# EAGLE design 4axis_DRV8818 (EAGLE 7.6.0)
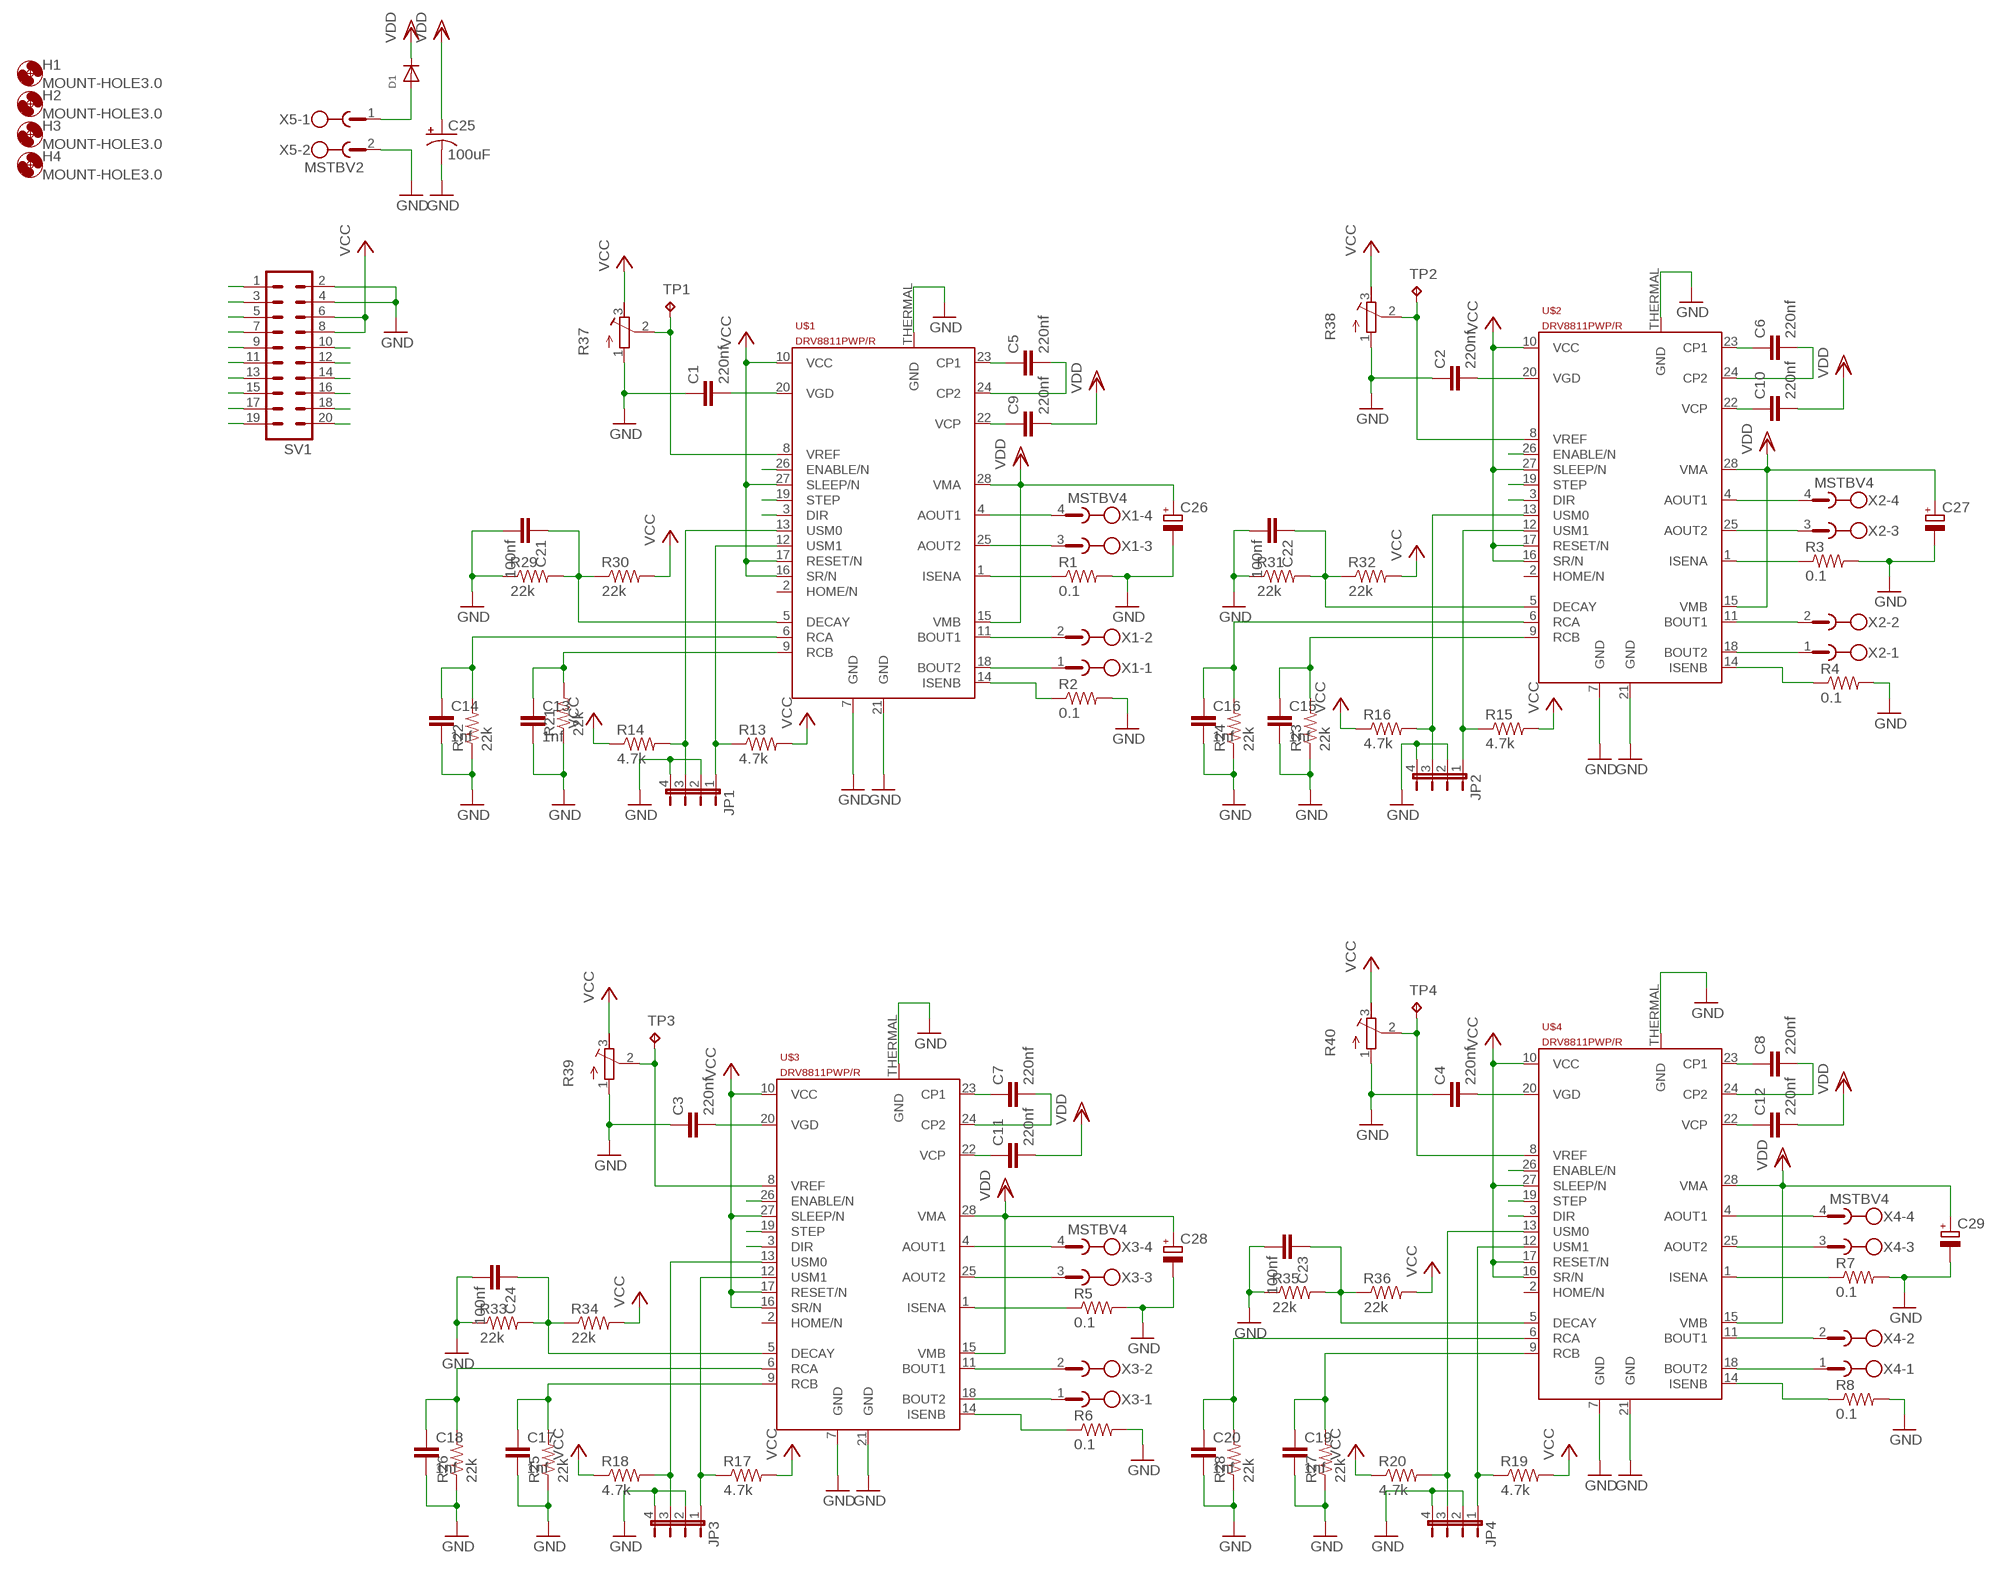
[diagram p0: schematic, sheet 1]

## Parts
C1  220nf  C-EUC1206  [C1206]
C2  220nf  C-EUC1206  [C1206]
C3  220nf  C-EUC1206  [C1206]
C4  220nf  C-EUC1206  [C1206]
C5  220nf  C-EUC1206  [C1206]
C6  220nf  C-EUC1206  [C1206]
C7  220nf  C-EUC1206  [C1206]
C8  220nf  C-EUC1206  [C1206]
C9  220nf  C-EUC1206  [C1206]
C10  220nf  C-EUC1206  [C1206]
C11  220nf  C-EUC1206  [C1206]
C12  220nf  C-EUC1206  [C1206]
C13  1nf  C-EUC1206  [C1206]
C14  1nf  C-EUC1206  [C1206]
C15  1nf  C-EUC1206  [C1206]
C16  1nf  C-EUC1206  [C1206]
C17  1nf  C-EUC1206  [C1206]
C18  1nf  C-EUC1206  [C1206]
C19  1nf  C-EUC1206  [C1206]
C20  1nf  C-EUC1206  [C1206]
C21  100nf  C-EUC1206  [C1206]
C22  100nf  C-EUC1206  [C1206]
C23  100nf  C-EUC1206  [C1206]
C24  100nf  C-EUC1206  [C1206]
C25  100uF  100UF-63V-20%(ELECT)  [NIC_10X10.5_CAP]
C26  CPOL-EUD  [PANASONIC_D]
C27  CPOL-EUD  [PANASONIC_D]
C28  CPOL-EUD  [PANASONIC_D]
C29  CPOL-EUD  [PANASONIC_D]
D1  DIODESMA  [SMADIODE]
H1  MOUNT-HOLE3.0  [3,0]
H2  MOUNT-HOLE3.0  [3,0]
H3  MOUNT-HOLE3.0  [3,0]
H4  MOUNT-HOLE3.0  [3,0]
JP1  JP4E  [JP4]
JP2  JP4E  [JP4]
JP3  JP4E  [JP4]
JP4  JP4E  [JP4]
R1  0.1  R-US_R2512  [R2512]
R2  0.1  R-US_R2512  [R2512]
R3  0.1  R-US_R2512  [R2512]
R4  0.1  R-US_R2512  [R2512]
R5  0.1  R-US_R2512  [R2512]
R6  0.1  R-US_R2512  [R2512]
R7  0.1  R-US_R2512  [R2512]
R8  0.1  R-US_R2512  [R2512]
R13  4.7k  R-US_R1206  [R1206]
R14  4.7k  R-US_R1206  [R1206]
R15  4.7k  R-US_R1206  [R1206]
R16  4.7k  R-US_R1206  [R1206]
R17  4.7k  R-US_R1206  [R1206]
R18  4.7k  R-US_R1206  [R1206]
R19  4.7k  R-US_R1206  [R1206]
R20  4.7k  R-US_R1206  [R1206]
R21  22k  R-US_R1206  [R1206]
R22  22k  R-US_R1206  [R1206]
R23  22k  R-US_R1206  [R1206]
R24  22k  R-US_R1206  [R1206]
R25  22k  R-US_R1206  [R1206]
R26  22k  R-US_R1206  [R1206]
R27  22k  R-US_R1206  [R1206]
R28  22k  R-US_R1206  [R1206]
R29  22k  R-US_R1206  [R1206]
R30  22k  R-US_R1206  [R1206]
R31  22k  R-US_R1206  [R1206]
R32  22k  R-US_R1206  [R1206]
R33  22k  R-US_R1206  [R1206]
R34  22k  R-US_R1206  [R1206]
R35  22k  R-US_R1206  [R1206]
R36  22k  R-US_R1206  [R1206]
R37  R-TRIMM3103  [RTRIM3103]
R38  R-TRIMM3103  [RTRIM3103]
R39  R-TRIMM3103  [RTRIM3103]
R40  R-TRIMM3103  [RTRIM3103]
SV1  ML20  [ML20]
TP1  TPTP20R  [TP20R]
TP2  TPTP20R  [TP20R]
TP3  TPTP20R  [TP20R]
TP4  TPTP20R  [TP20R]
U$1  DRV8811PWP/R  [HTSSOP28]
U$2  DRV8811PWP/R  [HTSSOP28]
U$3  DRV8811PWP/R  [HTSSOP28]
U$4  DRV8811PWP/R  [HTSSOP28]
X1  MSTBV4  [MSTBV4]
X2  MSTBV4  [MSTBV4]
X3  MSTBV4  [MSTBV4]
X4  MSTBV4  [MSTBV4]
X5  MSTBV2  [MSTBV2]

## Nets
E-DıR: SV1.14 U$4.3(DIR)
E-EN: SV1.16 U$4.26(ENABLE/N)
E-ERR: SV1.10
E-ISENA: R7.1 U$4.1(ISENA)
E-ISENB: R8.1 U$4.14(ISENB)
E-STEP: SV1.12 U$4.19(STEP)
GND: C1.1 C2.1 C3.1 C4.1 C13.2 C14.2 C15.2 C16.2 C17.2 C18.2 C19.2 C20.2 C21.2 C22.2 C23.2 C24.2 C25.- C26.- C27.- C28.- C29.- JP1.2 JP1.4 JP2.2 JP2.4 JP3.2 JP3.4 JP4.2 JP4.4 R1.2 R2.2 R3.2 R4.2 R5.2 R6.2 R7.2 R8.2 R21.1 R22.1 R23.1 R24.1 R25.1 R26.1 R27.1 R28.1 R29.1 R31.1 R33.1 R35.1 R37.1(A) R38.1(A) R39.1(A) R40.1(A) SV1.2 SV1.4 U$1.7(GND) U$1.21(GND) U$1.THERMAL(GND) U$2.7(GND) U$2.21(GND) U$2.THERMAL(GND) U$3.7(GND) U$3.21(GND) U$3.THERMAL(GND) U$4.7(GND) U$4.21(GND) U$4.THERMAL(GND) X5.2
N$1: C4.2 U$4.20(VGD)
N$2: C2.2 U$2.20(VGD)
N$3: C1.2 U$1.20(VGD)
N$4: U$1.4(AOUT1) X1.4
N$5: U$1.25(AOUT2) X1.3
N$6: U$1.11(BOUT1) X1.2
N$7: U$1.18(BOUT2) X1.1
N$8: U$2.4(AOUT1) X2.4
N$9: U$2.25(AOUT2) X2.3
N$10: U$2.11(BOUT1) X2.2
N$11: U$2.18(BOUT2) X2.1
N$12: U$4.4(AOUT1) X4.4
N$13: U$4.25(AOUT2) X4.3
N$14: U$4.11(BOUT1) X4.2
N$15: U$4.18(BOUT2) X4.1
N$16: U$3.4(AOUT1) X3.4
N$17: U$3.25(AOUT2) X3.3
N$18: U$3.11(BOUT1) X3.2
N$19: U$3.18(BOUT2) X3.1
N$20: C3.2 U$3.20(VGD)
N$21: C5.1 U$1.23(CP1)
N$22: C5.2 U$1.24(CP2)
N$23: C6.1 U$2.23(CP1)
N$24: C6.2 U$2.24(CP2)
N$25: C8.1 U$4.23(CP1)
N$26: C8.2 U$4.24(CP2)
N$27: C7.1 U$3.23(CP1)
N$28: C7.2 U$3.24(CP2)
N$29: C9.1 U$1.22(VCP)
N$30: C10.1 U$2.22(VCP)
N$31: C12.1 U$4.22(VCP)
N$32: C11.1 U$3.22(VCP)
N$33: R38.2(S) TP2.TP U$2.8(VREF)
N$34: R37.2(S) TP1.TP U$1.8(VREF)
N$35: R39.2(S) TP3.TP U$3.8(VREF)
N$36: JP1.3 R14.2 U$1.13(USM0)
N$37: R40.2(S) TP4.TP U$4.8(VREF)
N$38: JP1.1 R13.1 U$1.12(USM1)
N$39: JP2.1 R15.1 U$2.12(USM1)
N$40: JP2.3 R16.2 U$2.13(USM0)
N$41: JP3.1 R17.1 U$3.12(USM1)
N$42: JP3.3 R18.2 U$3.13(USM0)
N$43: JP4.1 R19.1 U$4.12(USM1)
N$44: JP4.3 R20.2 U$4.13(USM0)
N$45: C15.1 R23.2 U$2.9(RCB)
N$46: C16.1 R24.2 U$2.6(RCA)
N$47: C13.1 R21.2 U$1.9(RCB)
N$48: C14.1 R22.2 U$1.6(RCA)
N$49: C17.1 R25.2 U$3.9(RCB)
N$50: C18.1 R26.2 U$3.6(RCA)
N$51: C19.1 R27.2 U$4.9(RCB)
N$52: C20.1 R28.2 U$4.6(RCA)
N$53: C21.1 R29.2 R30.1 U$1.5(DECAY)
N$54: C22.1 R31.2 R32.1 U$2.5(DECAY)
N$55: C24.1 R33.2 R34.1 U$3.5(DECAY)
N$57: C23.1 R35.2 R36.1 U$4.5(DECAY)
N$58: D1.A X5.1
VCC: R13.2 R14.1 R15.2 R16.1 R17.2 R18.1 R19.2 R20.1 R30.2 R32.2 R34.2 R36.2 R37.3(E) R38.3(E) R39.3(E) R40.3(E) SV1.6 SV1.8 U$1.10(VCC) U$1.16(SR/N) U$1.17(RESET/N) U$1.27(SLEEP/N) U$2.10(VCC) U$2.16(SR/N) U$2.17(RESET/N) U$2.27(SLEEP/N) U$3.10(VCC) U$3.16(SR/N) U$3.17(RESET/N) U$3.27(SLEEP/N) U$4.10(VCC) U$4.16(SR/N) U$4.17(RESET/N) U$4.27(SLEEP/N)
VDD: C9.2 C10.2 C11.2 C12.2 C25.+ C26.+ C27.+ C28.+ C29.+ D1.C U$1.15(VMB) U$1.28(VMA) U$2.15(VMB) U$2.28(VMA) U$3.15(VMB) U$3.28(VMA) U$4.15(VMB) U$4.28(VMA)
X-DıR: SV1.3 U$1.3(DIR)
X-EN: SV1.1 U$1.26(ENABLE/N)
X-ERR: SV1.7
X-ISENA: R1.1 U$1.1(ISENA)
X-STEP: SV1.5 U$1.19(STEP)
XISENB: R2.1 U$1.14(ISENB)
Y-DıR: SV1.11 U$2.3(DIR)
Y-EN: SV1.9 U$2.26(ENABLE/N)
Y-ERR: SV1.15
Y-ISENA: R3.1 U$2.1(ISENA)
Y-ISENB: R4.1 U$2.14(ISENB)
Y-STEP: SV1.13 U$2.19(STEP)
Z-DıR: SV1.19 U$3.3(DIR)
Z-EN: SV1.17 U$3.26(ENABLE/N)
Z-ERR: SV1.18
Z-ISENA: R5.1 U$3.1(ISENA)
Z-ISENB: R6.1 U$3.14(ISENB)
Z-STEP: SV1.20 U$3.19(STEP)
Unconnected: U$1.2(HOME/N) U$2.2(HOME/N) U$3.2(HOME/N) U$4.2(HOME/N)

## Library data of the parts
C1-C24 = resistor:C-EU: CAPACITOR, European symbol
C25 = SparkFun-Capacitors:100UF-63V-20%(ELECT): CAP-08362 100uF electrolytic SMT 63V 20%; PROD_ID: CAP-08362
C26-C29 = resistor:CPOL-EU: POLARIZED CAPACITOR, European symbol
D1 = adafruit:DIODE: Diode SMADIODE - SMA Surface Mount Package 20V 1A Schottky Diode Digikey: 641-1014-6-ND DO-1N4148 - Through Hole Small Current Diode SOD-123 20V 1 A (.5mV Vf) Schottky Diode - Digikey: MBRX120TPMSCT-ND SOD-323 10V 570mA (.38mV Vf, 3ns) Schottky Diode - Digikey: ZLLS410CT-ND SOD-523 30V 30mA Schottky Diode (RB751S-40TE61) - Digikey: RB751S-40TE61CT-ND SOT23-R/W - SOT23 Package (R = Solder Paste/Reflow Ovens, W = Hand-Soldering) BAT54Film 40V 300mA - Digikey: 497-7162-1-ND
H1-H4 = holes:MOUNT-HOLE: MOUNTING HOLE with drill center marker
JP1-JP4 = jumper:JP4E: JUMPER
R1-R8 R13-R36 = resistor:R-US_: RESISTOR, American symbol
R37-R40 = resistor:R-TRIMM: Trimm resistor
SV1 = con-harting-ml:ML20: HARTING; OC_FARNELL: unknown; OC_NEWARK: unknown
TP1-TP4 = testpad:TP: Test pad
U$1-U$4 = texas-drv8811:DRV8811: Stepper Motor Controller The DRV8811 IC provides an integrated stepper motor driver solution. The device has two H-bridge drivers, as well as microstepping indexer logic to control a stepper motor. The output driver block for each consists of N-channel power MOSFETs configured as full H-bridges to drive the motor windings. Source: http://www.ti.com/lit/ds/symlink/drv8811.pdf; MF: TEXAS INSTRUMENTS
X1-X4 = con-phoenix-508:MSTBV4: PHOENIX; MPN: MSTBV 2,5/4-GF-5.08; OC_FARNELL: 1792794; OC_NEWARK: 69R9847
X5 = con-phoenix-508:MSTBV2: PHOENIX; MPN: MSTBV 2,5/2-GF-5.08; OC_FARNELL: 1792792; OC_NEWARK: 69R9845

## Net classes
0 default: width 0.305 mm, clearance 0.205 mm

## Board
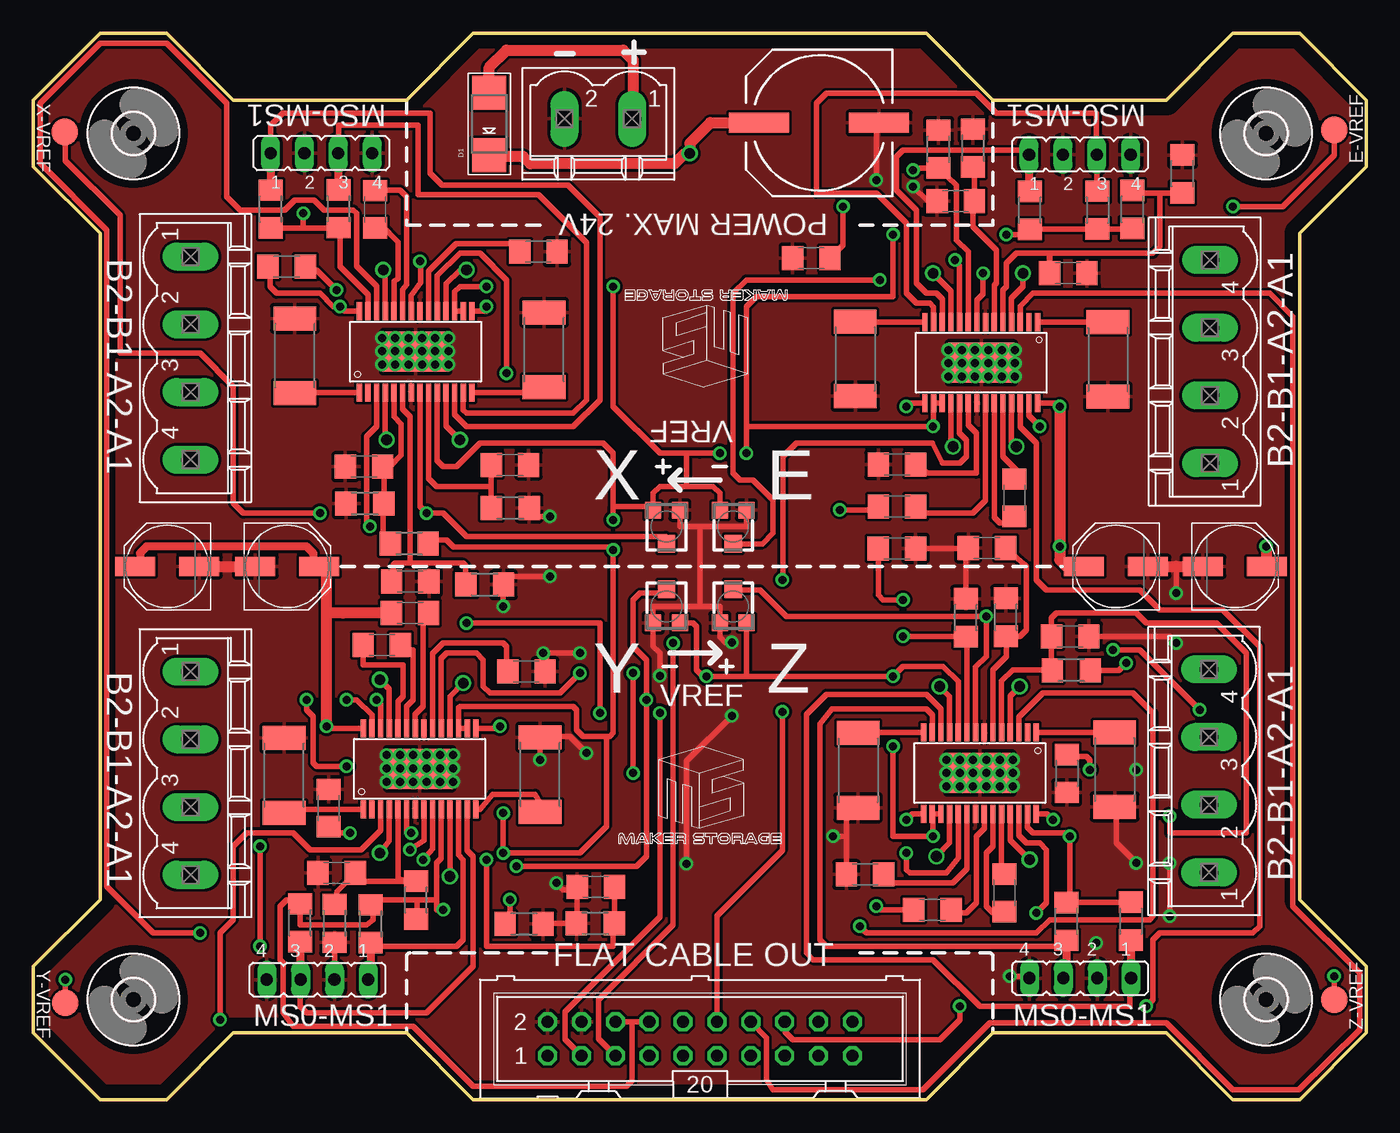
[diagram p1: board, top side]
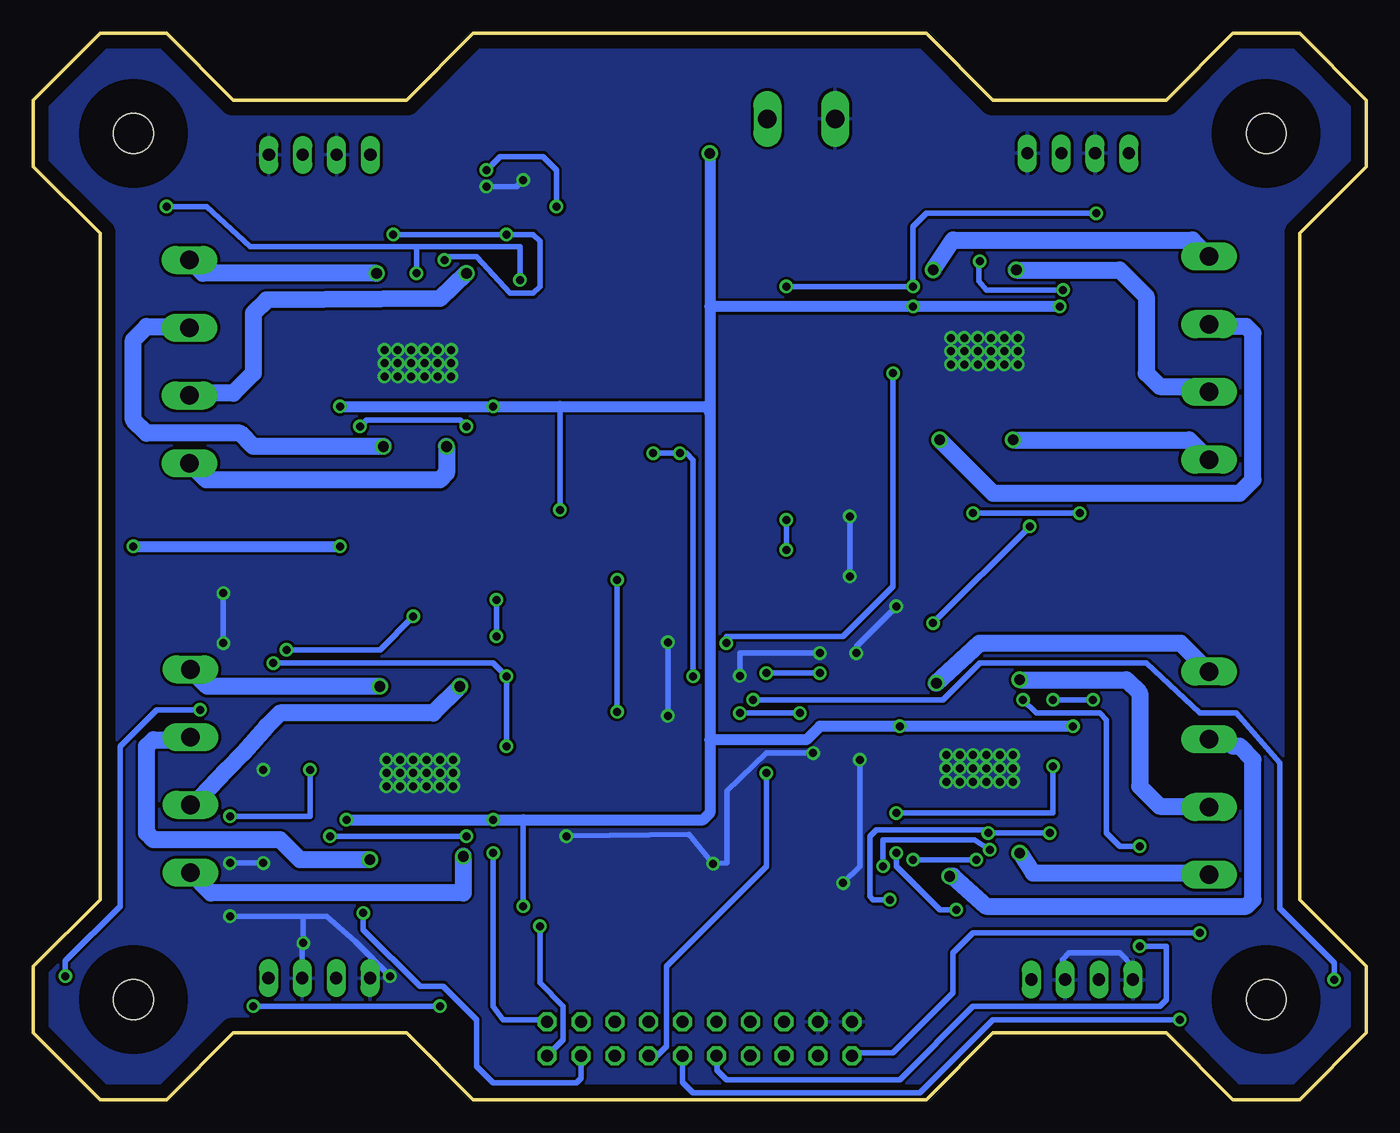
[diagram p2: board, bottom side, seen from below]

Size 100 x 80 mm. Coordinates in mm from the lower left corner, seen from the top.
Outline: 0,5 5,0 10,0 15,5 28,5 33,0 67,0 72,5 85,5 90,0 95,0 100,5 100,10 95,15 95,65 100,70 100,75 95,80 90,80 85,75 72,75 67,80 33,80 28,75 15,75 10,80 5,80 0,75 0,70 5,65 5,15 0,10 0,5
Copper layers (1*16): Top 0.035mm / dielectric 1.5mm / Bottom 0.035mm
Design rules "default": minimum track width 10mil, minimum drill 24mil, track to track 8mil, track to pad 8mil, pad to pad 8mil, via to via 8mil, smd to smd 8mil, copper to edge 40mil, drill to drill 8mil, minimum pad ring 10mil, minimum via ring 8mil, stop-mask expansion 4mil, vias tented up to drill 0mil, thermal gap 10mil

### Footprints (pad centres in the part's own frame; a part is rotated, then mirrored left to right if it is on the bottom)
C1206 = smd 1.6 x 1.8: 1 -1.4,0; 2 1.4,0
NIC_10X10.5_CAP = smd 4.5 x 1.5: + 4.5,0; - -4.5,0
PANASONIC_D = smd 3 x 1.4: + 2.4,0; - -2.4,0
SMADIODE = smd 2.54 x 2.54: A 2.349,0; C -2.349,0
3,0 = hole 3: 0,0
JP4 = drill 0.914 long: 1 -3.81,0; 2 -1.27,0; 3 1.27,0; 4 3.81,0
R2512 = smd 1.8 x 3.2: 1 -2.8,0; 2 2.8,0
R1206 = smd 1.6 x 1.803: 1 -1.422,0; 2 1.422,0
RTRIM3103 = smd 1.2 x 1.25: 1 -1,-1.225; 3 1,-1.225 | smd 1.3 x 1.3: 2 0,1.3
ML20 = drill 0.914 octagon: 1 -11.43,-1.27; 2 -11.43,1.27; 3 -8.89,-1.27; 4 -8.89,1.27; 5 -6.35,-1.27; 6 -6.35,1.27; 7 -3.81,-1.27; 8 -3.81,1.27; 9 -1.27,-1.27; 10 -1.27,1.27; 11 1.27,-1.27; 12 1.27,1.27; 13 3.81,-1.27; 14 3.81,1.27; 15 6.35,-1.27; 16 6.35,1.27; 17 8.89,-1.27; 18 8.89,1.27; 19 11.43,-1.27; 20 11.43,1.27
TP20R = smd 2 x 2: TP 0,0
HTSSOP28 = smd 1.35 x 0.4: 1 0.755,-0.855; 2 0.755,-1.505; 3 0.755,-2.16; 4 0.755,-2.805; 5 0.755,-3.46; 6 0.755,-4.105; 7 0.755,-4.755; 8 0.755,-5.405; 9 0.755,-6.055; 10 0.755,-6.71; 11 0.755,-7.355; 12 0.755,-8.01; 13 0.755,-8.655; 14 0.755,-9.305; 15 6.86,-9.305; 16 6.86,-8.655; 17 6.86,-8.01; 18 6.86,-7.355; 19 6.86,-6.71; 20 6.86,-6.055; 21 6.86,-5.405; 22 6.86,-4.755; 23 6.86,-4.105; 24 6.86,-3.46; 25 6.86,-2.805; 26 6.86,-2.16; 27 6.86,-1.505; 28 6.86,-0.855 | smd 3 x 5: THERMAL 3.81,-5.08
MSTBV4 = drill 1.397 long: 1 -7.62,0; 2 -2.54,0; 3 2.54,0; 4 7.62,0
MSTBV2 = drill 1.397 long: 1 -2.54,0; 2 2.54,0

### Placement (x,y rotation side)
C1  37.89,63.61 180 top
C2  36.99,32.11 180 top
C3  62.41,16.89 0 top
C4  64.81,47.64 0 top
C5  25.64,66.79 270 top
C6  26.14,34.11 180 top
C7  72.86,15.51 90 top
C8  73.61,45.16 90 top
C9  19.01,62.49 180 top
C10  28.26,36.49 180 top
C11  67.46,14.24 180 top
C12  64.81,44.49 180 top
C13  35.76,47.61 0 top
C14  28.28,38.86 0 top
C15  42.2,15.94 180 top
C16  22.14,21.87 90 top
C17  64.79,41.36 0 top
C18  71.54,41.39 180 top
C19  58.37,63.14 180 top
C20  69.2,67.39 180 top
C21  24.81,47.49 180 top
C22  22.76,16.99 180 top
C23  77.64,62.01 0 top
C24  77.79,34.76 0 top
C25  58.96,73.28 180 top
C26  10.06,40 180 top
C27  19.05,40 0 top
C28  90.16,40 0 top
C29  81.23,40 180 top
D1  34.2,73.2 90 top
H1  7.5,72.5 0 top
H2  92.5,72.5 0 top
H3  7.5,7.5 0 top
H4  92.5,7.5 0 top
JP1  21.61,71 0 top
JP2  21.32,9 180 top
JP3  78.55,9.11 180 top
JP4  78.52,70.89 0 top
R1  19.62,55.8 90 top
R2  38.32,56.26 90 top
R3  18.82,24.32 90 top
R4  38.02,24.38 90 top
R5  81.13,24.76 270 top
R6  61.88,24.7 270 top
R7  80.62,55.53 270 top
R8  61.67,55.57 270 top
R13  17.81,66.81 270 top
R14  22.89,66.84 90 top
R15  25.29,13.19 90 top
R16  20.01,13.26 270 top
R17  82.34,13.39 90 top
R18  77.51,13.36 270 top
R19  74.76,66.71 270 top
R20  79.84,66.74 90 top
R21  35.78,44.39 180 top
R22  33.86,38.64 180 top
R23  42.16,13.21 0 top
R24  36.82,13.19 180 top
R25  69.96,36.15 270 top
R26  72.96,36.18 270 top
R27  67.91,71.31 270 top
R28  70.51,71.39 270 top
R29  24.88,44.71 0 top
R30  28.2,41.71 0 top
R31  22.59,13.22 90 top
R32  28.71,14.96 270 top
R33  77.54,24.46 90 top
R34  77.88,32.21 0 top
R35  86.21,69.45 270 top
R36  82.46,66.78 270 top
R37  47.5,43 180 top
R38  47.5,37 0 top
R39  52.5,37 0 top
R40  52.5,43 180 top
SV1  50.02,4.55 0 top
TP1  2.35,72.6 0 top
TP2  2.4,7.25 0 top
TP3  97.6,7.5 0 top
TP4  97.6,72.75 0 top
U$1  23.6,52.3 90 top
U$2  23.9,21 90 top
U$3  76.1,28.3 270 top
U$4  76.2,59.1 270 top
X1  11.79,55.63 270 top
X2  11.79,24.49 270 top
X3  88.21,24.65 90 top
X4  88.28,55.37 90 top
X5  42.39,73.58 180 top

### Tracks (layer width: path | path; a pad name or v marks a point on that pad's centre or on a via)
E-DıR
  Top 0.406: U$4.3 74.04,59.54 75,60.5 92.75,60.5 94.5,58.75 94.5,14.5 99.5,9.5 99.5,5.25 94.95,0.75 90,0.75 85,5.75 71.75,5.75 66.75,0.75 55.5,0.75 55,1.5 55,4.65 SV1.14
E-EN  (via drill 0.6)
  Top 0.406: U$4.26 74.04,50.46 75.25,49.25 75.25,39 76,38.25 83,38.25 84.5,36.75 89.25,36.75 92,34 92,13 91.5,12.5 84.5,12.5 84,12 84,7.5 v83.5,7 | v69.5,7 69.5,6 68,4.5 57,4.5 56.4,5.1 56.4,5.79 SV1.16
  Bottom 0.406: v83.5,7 v69.5,7
E-ISENA
  Top 0.406: U$4.1 80.5,58.34 R7.1
E-ISENB
  Top 0.406: U$4.14 61.7,58.34 R8.1
E-STEP  (via drill 0.6)
  Top 0.406: U$4.19 69.49,50.01 70,49.5 70,48.25 69.5,47.75 68.2,47.75 67.45,49.25 57.25,49.25 56.25,48.25 56.25,39.25 v56.2,39 | SV1.12 51.3,7.91 51.3,13.8 56.2,18.7 v56.2,29.1
  Bottom 0.406: v56.2,39 v56.2,29.1
GND  (via drill 0.6)
  Top 0.406: R38.1 46.5,37 50,37 | 50,37 51.5,37 R39.1 51.5,34.7 51.9,34.3 v52.4,34.3 | R37.1 48.5,43 50,43 | 50,43 50,37 | R40.1 53.5,43 50,43 | R31.1 JP2.2 | R24.1 37.74,13.21 R23.1 40.8,13.21 C15.2 40.75,15.75 39.75,15.75 v39.25,16.25 | v35.25,37 35.25,38.25 R22.1 35.5,39.25 v38.75,39.25 | 38.5,33.5 38.5,32.25 C2.1 | v41,33.5 38.5,33.5 | R38.1 46.75,35.5 | 38.5,33.5 v38.25,33.5 | v38,25.5 38,27 R4.2 38.25,27.25 40.25,27.25 v41.5,26 | v38.75,43.75 37.25,43.75 37.25,44.25 R21.1 | 62,21.75 R6.2 61.01,21.03 61.01,19.75 | C3.1 61.01,19.75 | C17.2 70.11,41.36 C18.2 69.96,41.71 R25.1 70.13,37.4 | C24.2 85.26,34.76 v85.75,34.25 | v85.75,38 85.75,40 | C20.2 67.11,67.39 v66,68.5 | v63.25,69 63.25,73.07 C25.- | v60,19.75 61.01,19.75 | v73.25,9.25 74.5,9.25 JP3.4 | v85.25,17.75 v85.25,13.75 | v82.75,17.75 81.25,19.25 81.25,22 R5.2 | v47,31.8 47,33.5 46.5,34 R38.1 | v49,17.7 49,25.4 v52.4,28.8
  Top 0.813: C26.- C27.- | C29.- 85.75,40 C28.-
  Bottom 0.406: JP2.4 17.51,10.01 18.5,11 22.29,11 22.79,10.5 22.79,9.2 JP2.2 | v41,33.5 47,33.5 v47,31.8 | v39.25,16.25 38,17.5 v38,25.5 | v38.75,43.75 v38.75,39.25 | v38.25,33.5 38.25,34 v35.25,37 | v85.75,34.25 v85.75,38 | v66,68.5 63.75,68.5 v63.25,69 | v60,19.75 59.75,19.8 50.8,19.9 v49,17.7 47.95,17.75 47.95,23.15 45,26 v41.5,26 | v73.25,9.25 75.88,11.88 78,13.75 79.75,13.75 | v85.25,13.75 79.75,13.75 | v82.75,17.75 v85.25,17.75 | JP3.2 79.82,11.68 v79.75,11.75 79.75,13.75 | v52.4,34.3 v52.4,28.8
  other vias: 26.15,55.15 27.15,55.15 28.15,55.15 29.15,55.15 30.15,55.15 31.15,55.15 26.15,56.15 26.15,57.15 27.15,56.15 27.15,57.15 28.15,57.15 28.15,56.15 29.15,56.15 29.15,57.15 30.15,57.15 30.15,56.15 31.15,56.15 31.15,57.15 26.5,23.85 26.5,24.85 26.5,25.85 27.5,23.85 27.5,24.85 27.5,25.85 28.5,25.85 28.5,24.85 28.5,23.85 29.5,23.85 29.5,24.85 29.5,25.85 30.5,25.85 30.5,24.85 30.5,23.85 31.5,23.85 31.5,24.85 31.5,25.85 68.5,23.5 68.5,24.5 68.5,25.5 69.5,25.5 69.5,24.5 69.5,23.5 70.5,25.5 70.5,24.5 70.5,23.5 71.5,23.5 71.5,24.5 71.5,25.5 72.5,25.5 72.5,24.5 72.5,23.5 73.5,23.5 73.5,24.5 73.5,25.5 68.65,54.25 68.65,55.25 68.65,56.25 69.65,56.25 69.65,55.25 69.65,54.25 70.65,54.25 70.65,55.25 70.65,56.25 71.65,56.25 71.65,55.25 71.65,54.25 72.65,54.25 72.65,55.25 72.65,56.25 73.65,56.25 73.65,55.25 73.65,54.25 82.75,24.75
  pour Bottom: -0.5,4.5 4.5,-0.5 10.5,-0.5 15.5,4.5 28,4.5 33,-0.5 67.5,-0.5 72.5,4.5 85,4.5 90,-0.5 95,-0.5 100.5,5 100.5,11 95.5,16 95.5,64.5 100.5,69.5 100.5,75.5 95.5,80.5 89.5,80.5 84.5,75.5 72.5,75.5 67.5,80.5 33,80.5 28,75.5 15,75.5 10,80.5 5,80.5 -0.5,75 -0.5,69.5 4.5,64.5 4.5,15.5 -0.5,10.5
  pour Top: 0,4 4.5,-0.5 10.5,-0.5 15.5,4.5 28,4.5 32.5,0 33,-0.5 67.5,-0.5 72.5,4.5 85,4.5 90,-0.5 95,-0.5 100.5,5 100.5,10.5 100.5,11 95.5,16 95.5,64.5 100.5,69.5 100.5,75.5 95.5,80.5 89.5,80.5 85,76 84.5,75.5 72.5,75.5 67.5,80.5 33,80.5 28,75.5 15,75.5 10,80.5 5,80.5 -0.5,75 -0.5,69.5 4.5,64.5 4.5,15.5 -0.5,10.5 -0.5,4.5
N$1
  Top 0.406: U$4.20 70.14,50.6 70.75,50 70.75,47 67.1,47 C4.2
N$2
  Top 0.406: U$2.20 29.95,33.45 30.75,34.25 35.25,34.25 35.5,34 35.5,32.2 C2.2
N$3
  Top 0.406: U$1.20 29.66,62.16 31.7,64.2 35.9,64.2 36.25,63.75 36.35,63.75 C1.2
N$4  (via drill 0.8 pad 0.61)
  Top 0.406: U$1.4 26.41,49.59 v26.5,49.5
  Bottom 1.27: v26.5,49.5 13.28,49.5 X1.4
N$5  (via drill 0.8 pad 0.61)
  Top 0.406: U$1.25 26.41,62.16 v26.25,62.25
  Bottom 1.27: v26.25,62.25 18.5,62.25 16.5,60.25 16.5,54.5 15.5,53.5 12.2,53.5 X1.3
N$6  (via drill 0.8 pad 0.61)
  Top 0.406: U$1.11 30.95,50.55 v32,49.5
  Bottom 1.27: v32,49.5 28,45.5 9.5,45.5 8.5,46.5 8.5,57.5 9,58 11.62,58 X1.2
N$7  (via drill 0.8 pad 0.61)
  Top 0.406: U$1.18 30.95,61.2 32,62.25 v32.5,62.25
  Bottom 1.27: v32.5,62.25 31,64.5 13.04,64.5 X1.1
N$8  (via drill 0.8 pad 0.61)
  Top 0.406: U$2.4 26.7,19.41 v26,18.5
  Bottom 1.27: v26,18.5 25,17 11.92,17 X2.4
N$9  (via drill 0.6, 0.8 pad 0.61)
  Top 0.406: U$2.25 26.7,30.8 v26,31.5
  Bottom 1.27: v26,31.5 18,31.5 17,30.5 17,23.5 15.5,22 11.84,22 X2.3
N$10  (via drill 0.8 pad 0.61)
  Top 0.406: U$2.11 31.25,18.75 v31.25,16.75
  Bottom 1.27: X2.2 11.76,27 10.5,27 10,26.5 9.5,26.5 8.5,25.5 8.5,15 9,14.5 28.5,14.5 31,16.75 v31.25,16.75
N$11  (via drill 0.8 pad 0.61)
  Top 0.406: U$2.18 31.25,30.25 v32.25,31.25
  Bottom 1.27: v32.25,31.25 29,34.25 13.93,34.25 X2.1
N$12  (via drill 0.8 pad 0.61)
  Top 0.406: U$4.4 73.39,60.15 74.25,61 v74.25,62
  Bottom 1.27: v74.25,62 87.29,62 X4.4
N$13  (via drill 0.8 pad 0.61)
  Top 0.406: U$4.25 73.39,49.1 v73.75,49
  Bottom 1.27: v73.75,49 83.5,49 84.5,50 91.5,50 92.5,51 92.5,57 91.5,58 88.37,58 X4.3
N$14  (via drill 0.8 pad 0.61)
  Top 0.406: U$4.11 68.84,60.66 v67.5,62
  Bottom 1.27: X4.2 88.11,53 85,53 83.5,54.5 83.5,59 82.5,60 69.5,60.1 v67.5,62
N$15  (via drill 0.8 pad 0.61)
  Top 0.406: U$4.18 68.84,49.16 v69,49
  Bottom 1.27: v69,49 69,47 69.5,46.5 87.03,46.5 X4.1
N$16  (via drill 0.8 pad 0.61)
  Top 0.406: U$3.4 73.3,30.3 v74,31
  Bottom 1.27: v74,31 86.94,31 X3.4
N$17  (via drill 0.8 pad 0.61)
  Top 0.406: U$3.25 73.3,19.45 v74.75,18
  Bottom 1.27: v74.75,18 80,18 81.5,19.5 91,19.5 91.5,20 91.5,26.5 91,27 88.4,27 X3.3
N$18  (via drill 0.8 pad 0.61)
  Top 0.406: U$3.11 68.75,30.25 v68,31
  Bottom 1.27: v68,31 70,29 81.5,29 82.5,28 84.25,26 85.5,24.75 88.1,22 X3.2
N$19  (via drill 0.8 pad 0.61)
  Top 0.406: U$3.18 68.75,19.25 v67.75,18.25
  Bottom 1.27: v67.75,18.25 67.75,15.5 86.68,15.5 X3.1
N$20
  Top 0.406: U$3.20 70.05,17.3 69,16.25 64.45,16.25 C3.2
N$21
  Top 0.406: U$1.23 27.7,60.76 28,61.15 28,67.75 27.5,68.25 26.45,68.25 C5.1
N$22
  Top 0.406: U$1.24 27.06,61.41 27.35,61.6 27.35,64.35 26,65.7 26,65.53 C5.2
N$23
  Top 0.406: U$2.23 28,29.5 28.5,30 28.5,33.75 27.65,33.75 C6.1
N$24
  Top 0.406: U$2.24 27.36,29.86 27.75,30.25 27.75,32.6 24.75,32.6 24.75,33.5 C6.2
N$25
  Top 0.406: U$4.23 72.09,43.66 72.5,43.25 73.35,43.25 C8.1
N$26
  Top 0.406: U$4.24 72.74,48.26 73.75,47.25 73.75,46.2 C8.2
N$27
  Top 0.406: U$3.23 72,19 71.5,18.5 71.5,14.5 72,14 72.75,14 C7.1
N$28
  Top 0.406: U$3.24 72.64,17.13 C7.2
N$29  (via drill 0.6)
  Top 0.406: C9.1 20.5,62.25 21.25,62.25 v22.75,60.75 | U$1.22 28.36,60.3 29.05,61.3 29.05,62.65 v29,62.9
  Bottom 0.406: v22.75,60.75 28.5,60.75 29.05,61.4 29.05,62.75 v29,62.9
N$30
  Top 0.406: U$2.22 28.66,28.91 29.25,29.5 29.25,36.25 29.27,36 C10.1
N$31
  Top 0.406: U$4.22 71.44,44.95 70.5,44 66.22,44 C12.1
N$32
  Top 0.406: U$3.22 71.34,20.34 70.75,19.75 70.75,14.75 70,14 69.1,14 C11.1
N$33  (via drill 0.6)
  Top 0.406: v36.25,17.5 45.25,17.5 46,18.25 v46,30 46,33 45,34 45,37.5 45.5,38 47.2,38 R38.2 | U$2.8 29.3,19.46 28.26,18.76 v28.25,18.75 | TP2.TP v2.4,9
  Bottom 0.406: v36.25,17.5 36.25,19.5 29.4,19.5 v28.25,18.75 | v46,30 31.75,30 29,32.75 16.5,32.75 12.5,29 9.75,29 6.5,25.25 6.5,14.35 2.4,10.25 v2.4,9
N$34  (via drill 0.6)
  Top 0.406: R37.2 47.45,42.25 32.5,42.25 30.75,44 v29.5,44 29,44.49 U$1.8 | TP1.TP 1.75,72.75 2.4,72.45 2.4,70.45 6.5,66.35 6.5,56 12.5,56 15,53.5 15,44.75 15.75,44 v21.5,44
  Bottom 0.406: v21.5,44 v29.5,44
N$35  (via drill 0.6)
  Top 0.406: U$3.8 70.69,32.45 71.5,33.25 71.5,35.75 71.38,36.12 | 71.38,36.12 71.25,36.25 56.5,36.25 54.5,38.25 52.55,38.25 R39.2 | v71.5,36.25 71.5,36 71.38,36.12 | v81,33.75 83,33.75 v87.5,29.25 | TP3.TP v97.6,9.25
  Bottom 0.406: v71.5,36.25 74,33.75 v81,33.75 | v87.5,29.25 90.75,29.25 93.5,26.5 93.5,14.5 97.6,10.4 v97.6,9.25
N$36
  Top 0.406: R14.2 22.74,68.26 22.5,68.5 | U$1.13 32.26,51.74 32.5,51.5 40.5,51.5 41.5,52.5 41.5,64.3 37.9,67.9 28.85,67.9 28.85,73.1 22.9,73.1 22.9,71.22 JP1.3
  Top 0.61: JP1.3 22.88,68.27 R14.2
N$37  (via drill 0.6)
  Top 0.406: U$4.8 70.8,59.99 71.25,60.45 v71.25,62 | v63.5,61.5 53.5,61.5 52.5,60.5 52.5,47 53,46.5 54,46.5 55.5,45 55.5,42.5 54.7,41.7 R40.2 | v90,67 93.75,67 97.6,70.85 TP4.TP
  Bottom 0.406: v71.25,62 71.25,64 | 71.25,64 63.5,64 v63.5,61.5 | 71.25,64 83.75,64 87,67 v90,67
N$38
  Top 0.406: U$1.12 31.61,51.39 32.5,50.5 40.5,50.5 42.5,52.5 42.5,66.2 40.1,68.6 30.65,68.6 29.75,69.5 29.75,74 18.7,74 17.8,73.1 JP1.1
  Top 0.61: JP1.1 17.8,68.24 R13.1
N$39
  Top 0.406: R15.1 25.66,11.5 31.75,11.5 32.25,12 32.25,18 31.91,18.34 U$2.12
  Top 0.61: R15.1 25.29,9.16 JP2.1
N$40
  Top 0.406: JP2.3 20,8.95 20,7 20.5,6.5 29.5,6.5 33,10 33,18.25 32.55,18.7 U$2.13
  Top 0.61: R16.2 20.01,9.04 JP2.3
N$41
  Top 0.406: U$3.12 68.09,29.31 67,30.4 59.5,30.4 58,28.9 58,11 58.5,10.5 67.5,10.5 71,7 82.25,7 82.25,8.75 JP3.1
  Top 0.61: R17.1 82.34,9.13 JP3.1
N$42
  Top 0.406: U$3.13 67.44,28.86 67,29.3 59.9,29.3 59,28.2 59,12 59.5,11.5 76.82,11.5 R18.2
  Top 0.61: R18.2 77.51,9.38 JP3.3
N$43
  Top 0.406: 74.63,68 R19.1 | U$4.12 68.19,60.06 67.75,60.5 67,60.5 66.25,61.25 66.25,66.75 64.75,68.25 64.75,70.75 65.25,71.25 74.1,71.25 JP4.1
  Top 0.61: JP4.1 74.71,68.18 R19.1
N$44
  Top 0.406: 80,71.1 JP4.3 | JP4.3 79.79,68.21 R20.2 | U$4.13 67.55,59.45 67.25,59.75 66.25,59.75 65.5,60.5 65.5,65.75 63.25,68 58.75,68 58.75,74.75 59.5,75.5 70.75,75.5 72.25,74 79.75,74 79.75,70.93 JP4.3
N$45  (via drill 0.6)
  Top 0.406: C15.1 43.6,13.31 R23.2 43.5,13.03 43.5,11.5 34,11.5 v34,18 | U$2.9 29.95,18.8 v29.25,18
  Bottom 0.406: v29.25,18 v34,18
N$46  (via drill 0.6)
  Top 0.406: v35.75,15 35.75,13.39 R24.2 | U$2.6 28,20 v28.35,20 | C16.1 22.28,19.97 22.28,20 v23.75,20
  Bottom 0.406: v35.75,15 37,15 37.25,15.25 37.25,19.75 36.75,20.25 28.5,20.25 v28.35,20 v23.75,20
N$47
  Top 0.406: C13.1 34.36,46 | 34.36,46 34.36,44.49 R21.2 | 34.36,46 30.25,46 29.66,46.59 U$1.9
N$48
  Top 0.406: U$1.6 27.7,51.8 28.25,51.25 28.25,40.25 | 26.77,39 C14.1 27,39.23 27,40.1 27.15,40.25 28.25,40.25 | R22.2 32.44,40.06 32.25,40.25 28.25,40.25
N$49  (via drill 0.6)
  Top 0.406: U$3.9 70.05,34.64 R25.2 69.94,34.75 v65.25,34.75 | C17.1 63.39,37.86 63.75,37.5 v65.25,37.5
  Bottom 0.406: v65.25,37.5 v65.25,34.75
N$50
  Top 0.406: U$3.6 72,32.24 73,33.25 73,34.52 R26.2 73.15,34.75 74,34.75 74.5,35.25 74.5,40 74.36,40.14 C18.1
N$51  (via drill 0.6)
  Top 0.406: U$4.9 70.14,63.6 69.25,64.5 69.25,68.6 R27.2 66.14,69.89 v66,69.75 | v60.75,67 60.75,64.12 C19.1
  Bottom 0.406: v60.75,67 60.75,69.75 61.75,70.75 65,70.75 v66,69.75
N$52
  Top 0.406: R28.2 70.6,70.11 C20.1 70.5,67.29 70.5,65.5 72.25,63.75 72.25,61.25 72.09,61.09 U$4.6
N$53
  Top 0.406: U$1.5 27.06,51.24 27.6,50.7 27.6,48.35 26.75,47.5 26.32,47 C21.1 26.3,46.98 R29.2 26,44.51 26.25,44.51 26.25,42 26.78,42 R30.1 26.78,42.22
N$54
  Top 0.406: R31.2 22.79,15.62 C22.1 24.77,16.38 R32.1 28.59,16.5 27.5,16.5 27.36,16.64 U$2.5
N$55  (via drill 0.6)
  Top 0.406: 76.13,34.1 C24.1 | C24.1 76.39,32.21 R34.1 76.42,32.25 73.5,32.25 72.64,31.39 U$3.5 | C24.1 76.39,36.14 76.75,36.5 82.75,36.5 83.5,35.75 88.75,35.75 91,33.5 91,20 85.25,20 v85.25,21.25 | v79.25,24.75 79.25,25.5 79,25.75 77.92,25.75 R33.2
  Bottom 0.406: v85.25,21.25 79.25,21.25 v79.25,24.75
N$57
  Top 0.406: U$4.5 72.74,60.74 73,61 73,62.75 73.75,63.5 76.25,63.5 | 76.25,63.5 C23.1 76.24,63.49 76.25,63.5 | 76.25,63.5 84,63.5 84.5,64 84.5,68 | 84.5,68 82.51,68 R36.1 | R35.2 86.03,68.53 85.5,68 84.5,68
N$58
  Top 0.813: D1.A 34.2,77.45 35.5,78.75 44.25,78.75 45,78 45,73.65 X5.1
N$59  (via drill 0.6)
  other vias: 35,28
N$61  (via drill 0.6)
  other vias: 65.5,21
N$63  (via drill 0.6)
  other vias: 65.5,52
N$66  (via drill 0.6)
  other vias: 85.25,21.25
N$74  (via drill 0.6)
  other vias: 64.5,26.5
N$77  (via drill 0.6)
  other vias: 92.5,41.5
N$82  (via drill 0.6)
  other vias: 12.5,12.5
VCC  (via drill 0.6)
  Top 0.406: U$1.16 U$1.17 31.61,60.61 32,61 v34,61 | R13.2 20.25,65.39 | 20.25,65.39 22.86,65.39 R14.1 23,65.31 23,62.5 25.11,60.4 U$1.27 | U$4.17 U$4.16 67.55,50.55 v67.5,50.5 53.5,50.5 | R17.2 77.29,14.81 R18.1 | 25.32,14.68 R15.2 | U$3.16 U$3.17 67.56,21.44 67.5,21.5 v67.5,19.75 64.5,19.75 v64.5,26.5 | 77,15.04 R18.1 | U$2.16 U$2.17 31.91,29.41 32,29.5 40.5,29.5 40.75,29.25 40.75,27.75 41.25,27.25 43,27.25 | SV1.8 SV1.6 44.68,5.82 44.9,5.8 44.9,1.4 44.5,1 33,1 28.5,5.5 19.5,5.5 18.75,6.5 18.75,10.25 18.5,10.5 18.5,14.5 19,15 19.69,15 R16.1 20.01,13.11 20,13.1 25,13.1 25.5,13.5 25.5,14.5 R15.2 | U$3.10 69.39,31.36 68.25,32.5 65.25,32.5 v64.5,31.75 53.5,31.75 | R39.3 53.5,31.75 | R40.3 51.5,45.5 51,46 49,46 | 49,46 47,46 46.5,45.5 46.5,44.5 | 50,48.5 v51.5,48.5 49,48.5 | 49,48.5 49,46 | v43.5,43.5 43.5,44.5 | 46.5,44.5 43.5,44.5 | 46.5,44.5 R37.3 | U$2.10 30.61,18.11 30.25,17.75 30.25,15 | 30.25,15 28.8,15 | 28.8,15 25.78,15 R15.2 | v35.25,21.5 v35.25,18.5 41,18.5 43,20.5 43,27.25 | 53.5,50.5 53.5,59.5 54.25,60.25 64.5,60.25 v64.5,64.9 | v73,64.9 73.97,64.9 R19.2 74.79,65.32 R20.1 82.46,65.32 R36.2 | v53.5,48.5 53.5,50.5 | v30.75,14.25 30.25,14.25 30.25,15 | 43.5,44.5 43.5,48.5 42.75,49.25 33.5,49.25 31.75,47.5 30.75,47.5 30.31,47.94 U$1.10 | R30.2 29.83,42 31,42 31.54,41.46 43.5,41.46 v43.5,41.25 43.5,27.5 43.25,27.25 43,27.25 | U$3.27 74.59,20.41 75,20 77.5,20 v77.75,19.75 77.75,15.02 R18.1 | U$4.10 69.49,62.56 v69.15,63 | 75.5,50.25 v75.5,50.5 74.69,51.3 U$4.27 | R34.2 81.46,32.21 v82,32.75 | 49,48.5 47,48.5 43.5,52 v43.5,61 | 53.5,31.75 v50.5,31.75 50.25,31.75 49.75,32.25 49.75,35.5 49.5,35.75 48.52,35.75 R38.3
  Top 0.406: v20.25,66.5 20.25,65.39 | R32.2 28.8,13.54 28.8,15 | U$2.27 25.41,28.84 24.25,30 v23.5,30 | v20.5,30 20.5,29.25 21,28.75 21,25.25 21.25,25 v23.5,25
  Bottom 0.406: v67.5,19.75 v77.75,19.75 | v64.5,26.5 v64.5,31.75 65.5,32.75 v82,32.75 | v53.5,48.5 v51.5,48.5 51,48.5 50.5,48 v50.5,31.75 | v43.5,61 v34,61 34,65.5 33,66.5 v20.25,66.5 | v43.5,41.25 v43.5,43.5 | v73,64.9 v64.5,64.9 62.5,64.9 62,64.4 62,61 62.5,60.5 64.25,60.5 66.75,63.25 69,63.25 v69.15,63 | v35.25,21.5 23.5,21.5 v23.5,25 | v35.25,18.5 35.25,17.5 32,14.25 v30.75,14.25 | v75.5,50.5 75,51 68,51 v67.5,50.5 | v23.5,30 v20.5,30
VDD  (via drill 0.6, 0.8)
  Top 0.406: U$1.15 34,59.16 v34,59.5 | U$1.28 23.34,59.16 v23,59.5 22.5,59.5 21.5,60.5 18.25,60.5 17.75,61 17.75,62.35 C9.2 | U$2.15 34.86,27.86 v35,28 | U$2.28 21.89,27.86 v22,28 | U$3.15 65.94,21.44 v65.5,21 | U$3.28 76.06,21.44 v76.5,21 | U$4.15 65.74,52.24 v65.5,52 | U$4.28 76.76,52.24 v77,52 | C11.2 63.51,14.24 v63.25,14.5 | v60.5,44.25 63.25,44.25 C12.2
  Top 0.61: C27.+ 21,40.05 21,41 20.5,41.5 8.5,41.5 8,41 8,40.34 C26.+
  Top 0.813: v22,28 22,36.5 | 22,36.5 22,39.45 C27.+ | v77,52 v77,41.5 77,40.5 77.5,40 C29.+ | C28.+ 92.56,41.44 v92.5,41.5 | C10.2 23.24,36.49 22,36.5 | v49.25,71 49.25,71.05 | C25.+ 54.44,73.3 50.8,73.3 49.25,71.75 49.25,71.05 | 49.25,71.05 49.3,71 48.9,71 48.1,70.2 37.3,70.2 36.75,70.75 34.3,70.75 D1.C
  Bottom 0.406: 63.25,21 v63.25,14.5 | 60.5,52 v60.5,44.25
  Bottom 0.813: v49.25,71 49.25,59.5 | 49.25,59.5 49.25,51.5 | 49.25,51.5 49.25,27 | 49.25,27 49.25,21.5 49.75,21 63.25,21 v65.5,21 v76.5,21 | 49.25,59.5 v34,59.5 v23,59.5 | v22,28 v35,28 41,28 42,27 49.25,27 | 49.25,51.5 49.5,52 60.5,52 v65.5,52 v77,52 | v92.5,41.5 v77,41.5
X-DıR  (via drill 0.6)
  Top 0.406: v42.5,29 42.5,35.75 v32.5,35.75 | v47,29 47,13.7 39.9,6.6 39.9,4.51 SV1.3 | v25.25,43 25,43.25 25,49.75 25.76,50.51 U$1.3
  Bottom 0.406: v42.5,29 v47,29 | v32.5,35.75 v25.25,43
X-EN  (via drill 0.6)
  Top 0.406: U$1.26 25.76,61.04 24.25,62.55 24.25,66.5 24,66.75 21.8,66.75 21.05,67.5 19.6,67.5 18.85,66.75 15.5,66.75 14.5,67.75 14.5,74.75 10,79.25 5,79.25 0.5,74.75 0.5,70.25 5.5,65.25 5.5,16 9,12.5 v12.5,12.5
  Bottom 0.406: v12.5,12.5 29.5,12.5 31,11 31,8 35.5,3.5 38.37,3.5 SV1.1
X-ISENA
  Top 0.406: U$1.1 19.68,53.05 R1.1
X-STEP  (via drill 0.6)
  Top 0.406: v48,34.25 48,13.1 42.4,7.5 42.4,4.55 SV1.5 | U$1.19 30.31,61.81 32,63.5 33.5,63.5 35.5,61.5 v35.5,54.5
  Bottom 0.406: v35.5,54.5 35.5,38.5 39.25,34.75 48,34.75 v48,34.25
XISENB
  Top 0.406: U$1.14 38.31,53.05 R2.1
Y-DıR  (via drill 0.6)
  Top 0.406: U$2.3 26.06,20.21 24.6,18.75 20.75,18.75 19.5,20 16,20 15,19 15,13.5 14,12.5 v14,6
  Bottom 0.406: v14,6 28,6 33.5,0.5 50.5,0.5 51.3,1.3 51.3,2.87 SV1.11
Y-EN  (via drill 0.6)
  Top 0.406: v17,19 v17,11.5 | U$2.26 26.06,29.69 v25.75,30
  Bottom 0.406: v17,19 18.5,19 19.5,20 19.5,28.5 20,29 24.75,29 v25.75,30 | v17,11.5 15,11.5 15,7.5 15.5,7 29.5,7 35,1.5 48,1.5 48.7,2.2 48.7,3.23 SV1.9
Y-ISENA
  Top 0.406: U$2.1 19.66,21.75 R3.1
Y-ISENB
  Top 0.406: 38.34,21.75 R4.1 38,21.6 38,22.25 37.65,22.9 34.45,22.9 33.51,21.75 U$2.14
Y-STEP  (via drill 0.6)
  Top 0.406: v45,24.5 v45,32 | U$2.19 30.61,33.11 31,33.5 33.25,33.5 33.75,33 33.75,31 34.25,30.5 39.5,30.5 v41,32
  Bottom 0.406: SV1.13 53.22,3.28 52.5,4 52.5,10 45,17.5 v45,24.5 | v45,32 v41,32
Z-DıR  (via drill 0.6)
  Top 0.406: U$3.3 73.94,28.69 75.75,30.5 82.5,30.5 84,29 84,13.75 83.75,13.5 76.25,13.5 75.25,12.5 62.5,12.5 v62,13
  Bottom 0.406: v62,13 62,8.75 60.25,7 60.25,4.48 SV1.19
Z-EN  (via drill 0.6)
  Top 0.406: U$3.26 73.94,19.81 74.5,19.25 75.5,19.25 76,18.75 76,14.75 v75.25,14
  Bottom 0.406: SV1.17 58.91,1.59 59.25,1.25 65.5,1.25 66.75,2.5 66.75,6 69.25,8.5 71,8.5 75.25,12.75 v75.25,14
Z-ISENA
  Top 0.406: U$3.1 80.36,27.55 R5.1
Z-ISENB
  Top 0.406: U$3.14 61.92,27.55 R6.1
Z-STEP  (via drill 0.6)
  Top 0.406: U$3.19 69.39,18.14 68.5,17 65.75,17 65.5,17.25 v65.5,18.5
  Bottom 0.406: v65.5,18.5 65.5,7 64.75,6 61.63,6 SV1.20

### Text on the board
tPlace: X-VREF | MS0-MS1 | MS0-MS1 | E-VREF | POWER MAX. 24V | B2-B1-A2-A1 | B2-B1-A2-A1 | VREF | X | E | Y | VREF | Z | B2-B1-A2-A1 | B2-B1-A2-A1 | Y-VREF | FLAT CABLE OUT | MS0-MS1 | MS0-MS1 | Z-VREF